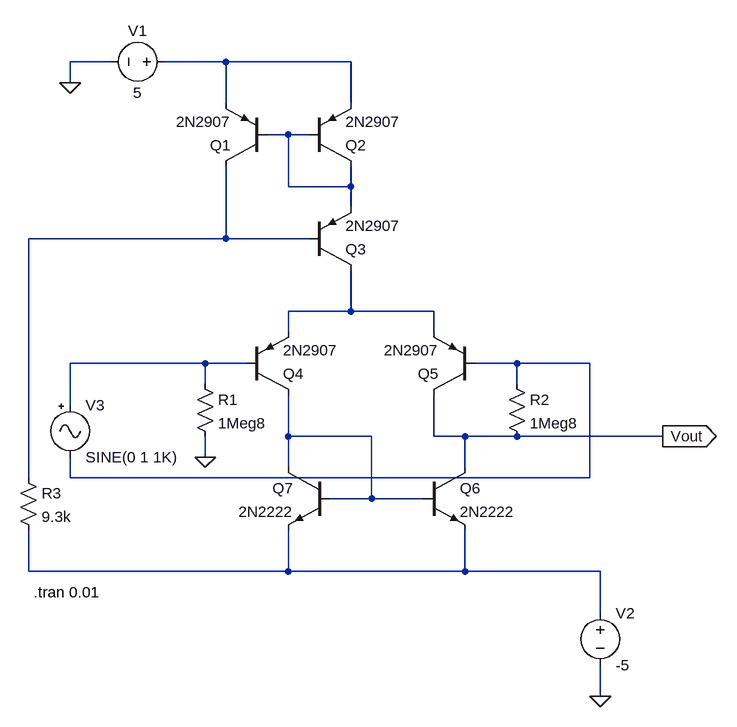
[diagram p0: schematic block1.asc]
block1.asc, the LTspice schematic file:
Version 4
SHEET 1 1204 1088
WIRE 256 -16 192 -16
WIRE 432 -16 336 -16
WIRE 624 -16 432 -16
WIRE 192 16 192 -16
WIRE 432 48 432 -16
WIRE 624 48 624 -16
WIRE 528 96 496 96
WIRE 560 96 528 96
WIRE 528 176 528 96
WIRE 624 176 624 144
WIRE 624 176 528 176
WIRE 624 208 624 176
WIRE 432 256 432 144
WIRE 432 256 128 256
WIRE 560 256 432 256
WIRE 624 368 624 304
WIRE 624 368 528 368
WIRE 752 368 624 368
WIRE 528 400 528 368
WIRE 752 400 752 368
WIRE 400 448 192 448
WIRE 464 448 400 448
WIRE 880 448 816 448
WIRE 992 448 880 448
WIRE 400 480 400 448
WIRE 880 480 880 448
WIRE 192 512 192 448
WIRE 528 560 528 496
WIRE 656 560 528 560
WIRE 752 560 752 496
WIRE 800 560 752 560
WIRE 880 560 800 560
WIRE 1104 560 880 560
WIRE 400 592 400 560
WIRE 528 608 528 560
WIRE 800 608 800 560
WIRE 128 624 128 256
WIRE 192 624 192 592
WIRE 992 624 992 448
WIRE 992 624 192 624
WIRE 656 656 656 560
WIRE 656 656 592 656
WIRE 736 656 656 656
WIRE 128 768 128 704
WIRE 528 768 528 704
WIRE 528 768 128 768
WIRE 800 768 800 704
WIRE 800 768 528 768
WIRE 1008 768 800 768
WIRE 1008 832 1008 768
WIRE 1008 960 1008 912
FLAG 192 16 0
FLAG 1008 960 0
FLAG 400 592 0
FLAG 1104 560 Vout
IOPIN 1104 560 Out
SYMBOL voltage 352 -16 R90
WINDOW 0 -32 56 VBottom 2
WINDOW 3 32 56 VTop 2
SYMATTR InstName V1
SYMATTR Value 5
SYMBOL pnp 496 144 R180
SYMATTR InstName Q1
SYMATTR Value 2N2907
SYMBOL pnp 560 144 M180
SYMATTR InstName Q2
SYMATTR Value 2N2907
SYMBOL pnp 560 304 M180
SYMATTR InstName Q3
SYMATTR Value 2N2907
SYMBOL pnp 464 496 M180
SYMATTR InstName Q4
SYMATTR Value 2N2907
SYMBOL pnp 816 496 R180
SYMATTR InstName Q5
SYMATTR Value 2N2907
SYMBOL res 384 464 R0
SYMATTR InstName R1
SYMATTR Value 1Meg8
SYMBOL res 864 464 R0
SYMATTR InstName R2
SYMATTR Value 1Meg8
SYMBOL res 112 608 R0
SYMATTR InstName R3
SYMATTR Value 9.3k
SYMBOL npn 736 608 R0
SYMATTR InstName Q6
SYMATTR Value 2N2222
SYMBOL npn 592 608 M0
SYMATTR InstName Q7
SYMATTR Value 2N2222
SYMBOL voltage 1008 816 R0
SYMATTR InstName V2
SYMATTR Value -5
SYMBOL Misc/signal 192 496 R0
SYMATTR InstName V3
TEXT 136 800 Left 2 !.tran 0.01

The netlist it stands for:
* block1.asc
V1 N001 0 5
Q1 N003 N002 N001 0 2N2907
Q2 N002 N002 N001 0 2N2907
Q3 N004 N003 N002 0 2N2907
Q4 N007 N005 N004 0 2N2907
Q5 Vout N006 N004 0 2N2907
R1 N005 0 1Meg8
R2 N006 Vout 1Meg8
R3 N003 N008 9.3k
Q6 Vout N007 N008 0 2N2222
Q7 N007 N007 N008 0 2N2222
V2 N008 0 -5
V3 N005 N006 SINE(0 1 1K)
.model NPN NPN
.model PNP PNP
.lib standard.bjt
.tran 0.01
.backanno
.end